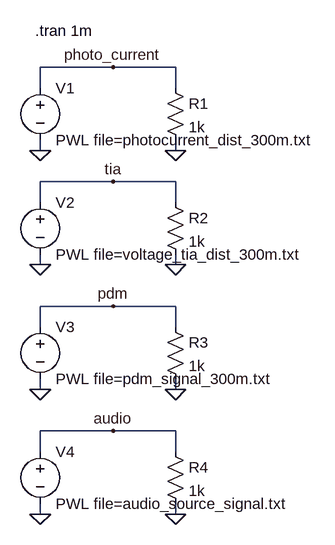
[diagram p0: schematic show_file.asc]
show_file.asc, the LTspice schematic file:
Version 4.1
SHEET 1 880 788
WIRE 128 80 16 80
WIRE 224 80 128 80
WIRE 16 112 16 80
WIRE 224 112 224 80
WIRE 16 208 16 192
WIRE 224 208 224 192
WIRE 128 256 16 256
WIRE 224 256 128 256
WIRE 16 288 16 256
WIRE 224 288 224 256
WIRE 16 384 16 368
WIRE 224 384 224 368
WIRE 128 448 16 448
WIRE 224 448 128 448
WIRE 16 480 16 448
WIRE 224 480 224 448
WIRE 16 576 16 560
WIRE 224 576 224 560
WIRE 128 640 16 640
WIRE 224 640 128 640
WIRE 16 672 16 640
WIRE 224 672 224 640
WIRE 16 768 16 752
WIRE 224 768 224 752
FLAG 16 208 0
FLAG 224 208 0
FLAG 16 384 0
FLAG 224 384 0
FLAG 16 576 0
FLAG 224 576 0
FLAG 16 768 0
FLAG 224 768 0
FLAG 128 640 audio
FLAG 128 448 pdm
FLAG 128 80 photo_current
FLAG 128 256 tia
SYMBOL voltage 16 96 R0
WINDOW 123 0 0 Left 0
WINDOW 39 0 0 Left 0
SYMATTR InstName V1
SYMATTR Value PWL file=photocurrent_dist_300m.txt
SYMBOL res 208 96 R0
SYMATTR InstName R1
SYMATTR Value 1k
SYMBOL voltage 16 272 R0
WINDOW 123 0 0 Left 0
WINDOW 39 0 0 Left 0
SYMATTR InstName V2
SYMATTR Value PWL file=voltage_tia_dist_300m.txt
SYMBOL res 208 272 R0
SYMATTR InstName R2
SYMATTR Value 1k
SYMBOL voltage 16 464 R0
WINDOW 123 0 0 Left 0
WINDOW 39 0 0 Left 0
SYMATTR InstName V3
SYMATTR Value PWL file=pdm_signal_300m.txt
SYMBOL res 208 464 R0
SYMATTR InstName R3
SYMATTR Value 1k
SYMBOL voltage 16 656 R0
WINDOW 123 0 0 Left 0
WINDOW 39 0 0 Left 0
SYMATTR InstName V4
SYMATTR Value PWL file=audio_source_signal.txt
SYMBOL res 208 656 R0
SYMATTR InstName R4
SYMATTR Value 1k
TEXT 8 24 Left 2 !.tran 1m

The netlist it stands for:
* show_file.asc
V1 photo_current 0 PWL file=photocurrent_dist_300m.txt
R1 photo_current 0 1k
V2 tia 0 PWL file=voltage_tia_dist_300m.txt
R2 tia 0 1k
V3 pdm 0 PWL file=pdm_signal_300m.txt
R3 pdm 0 1k
V4 audio 0 PWL file=audio_source_signal.txt
R4 audio 0 1k
.tran 1m
.backanno
.end